# Altium schematic sheet 01-Cover.SchDoc: Information Coverpage
size A3; DocumentNumber: 1; SheetNumber: 1; SheetTotal: 12
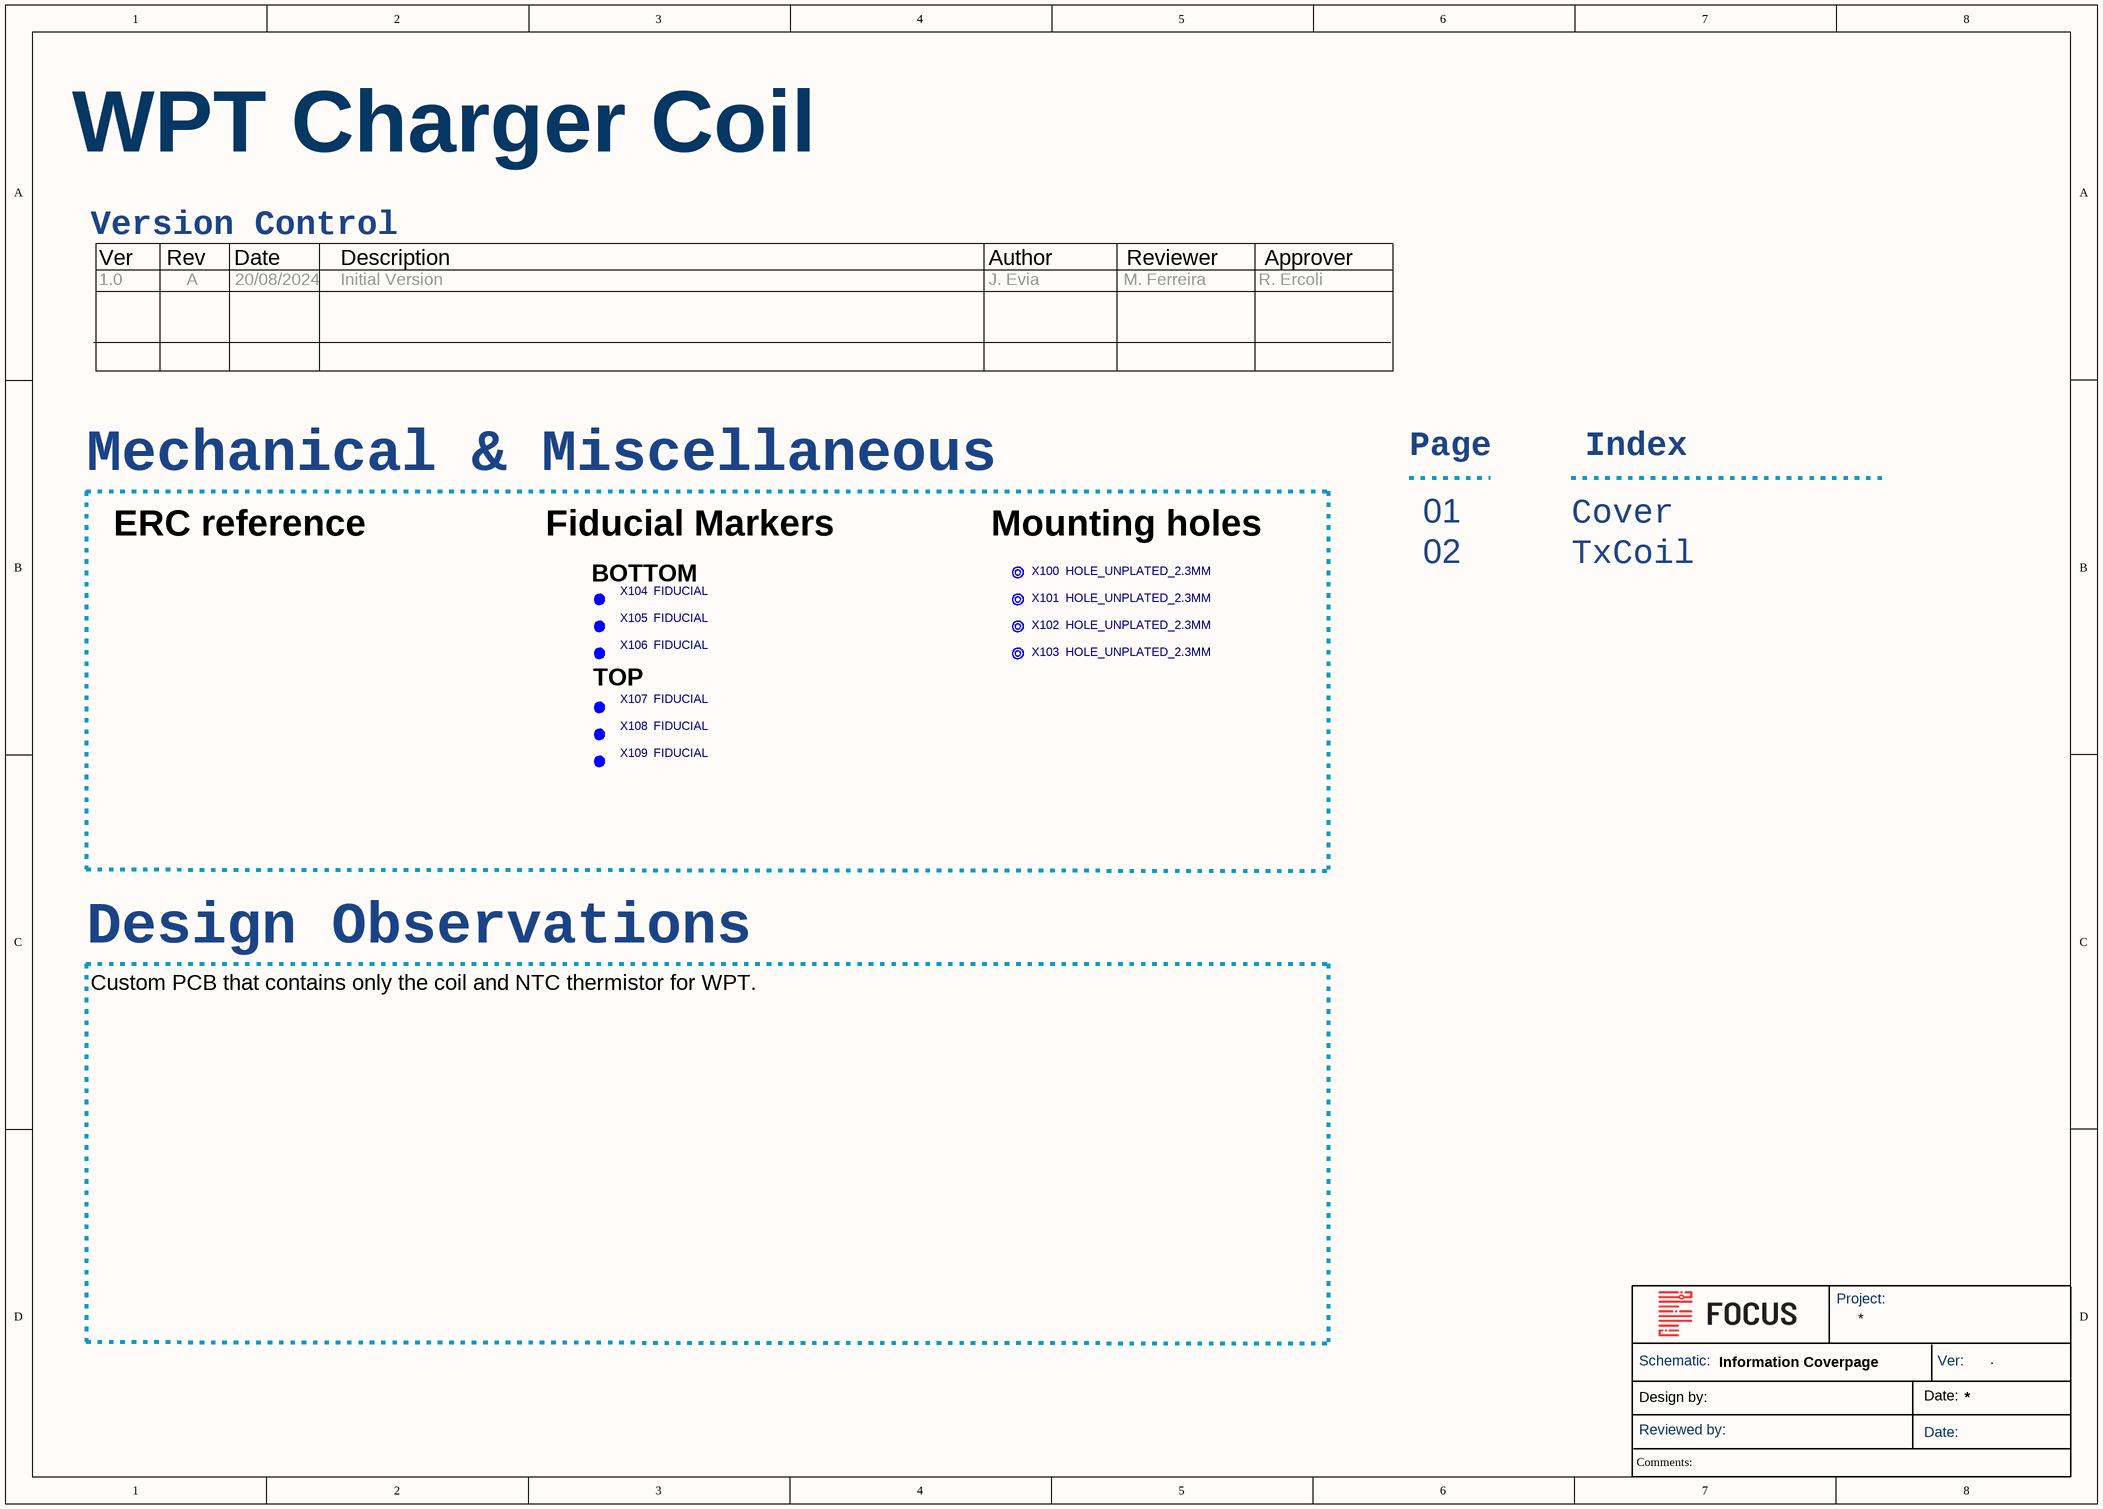
[diagram p0: 01-Cover.SchDoc]

## Parts
X100  HOLE_UNPLATED_2.3MM  [HOLE_UNPLATED_2.3MM_COUNTERSINK]  (no BOM)
X101  HOLE_UNPLATED_2.3MM  [HOLE_UNPLATED_2.3MM_COUNTERSINK]  (no BOM)
X102  HOLE_UNPLATED_2.3MM  [HOLE_UNPLATED_2.3MM_COUNTERSINK]  (no BOM)
X103  HOLE_UNPLATED_2.3MM  [HOLE_UNPLATED_2.3MM_COUNTERSINK]  (no BOM)
X104  FIDUCIAL  [Fid_IPC-7351B]  (no BOM)
X105  FIDUCIAL  [Fid_IPC-7351B]  (no BOM)
X106  FIDUCIAL  [Fid_IPC-7351B]  (no BOM)
X107  FIDUCIAL  [Fid_IPC-7351B]  (no BOM)
X108  FIDUCIAL  [Fid_IPC-7351B]  (no BOM)
X109  FIDUCIAL  [Fid_IPC-7351B]  (no BOM)

## Sub-sheets
U_System = 02-TxCoil.SchDoc: no entries

## Notes on the sheet
- WPT Charger Coil
- Version Control
- Ver
- 1.0
- Rev
- A
- Date
- 20/08/2024
- Description
- Initial Version
- Author
- J. Evia
- M. Ferreira
- Reviewer
- R. Ercoli
- Approver
- Mechanical & Miscellaneous
- Page
- Index
- ERC reference
- Fiducial Markers
- (near X104) BOTTOM
- (near X100) Mounting holes
- 01
- 02
- Cover
- TxCoil
- TOP
- Design Observations
- Custom PCB that contains only the coil and NTC thermistor for WPT.
- Project:
- Schematic:
- Ver:
- .
- Design by:
- Reviewed by:
- Date:
- Comments:

## Library data of the parts
X100-X103 = HOLE_UNPLATED_2.3MM: Hole, Unplated, 2.3mm; Status: *; Review: *
X104-X109 = FIDUCIAL: FIDUCIAL_MARK; Manufacturer PN: FIDUCIAL; Status: *; Review: *